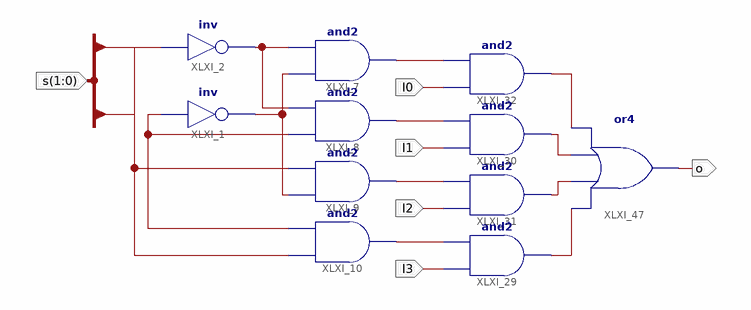
[diagram p0: schematic sheet 1]
// Xilinx ISE schematic Mux4to1.sch (kintex7) as structural Verilog: 11 symbols, 6 ports
module Mux4to1 (
  input  [1:0] s,
  input  I3,
  input  I2,
  input  I1,
  input  I0,
  output o
);

  wire NS0, NS1, S0, S1, S2, S3, XLXN_66, XLXN_67, XLXN_68, XLXN_69;

  and XLXI_10 (S3, s[1], s[0]);
  and XLXI_8 (S1, s[0], NS1);
  and XLXI_9 (S2, NS0, s[1]);
  and XLXI_7 (S0, NS0, NS1);
  not XLXI_2 (NS1, s[1]);
  not XLXI_1 (NS0, s[0]);
  and XLXI_32 (XLXN_66, I0, S0);
  and XLXI_31 (XLXN_68, I2, S2);
  and XLXI_30 (XLXN_67, I1, S1);
  and XLXI_29 (XLXN_69, I3, S3);
  or XLXI_47 (o, XLXN_69, XLXN_68, XLXN_67, XLXN_66);
endmodule
